# EAGLE design Active Load (EAGLE 7.2.0)
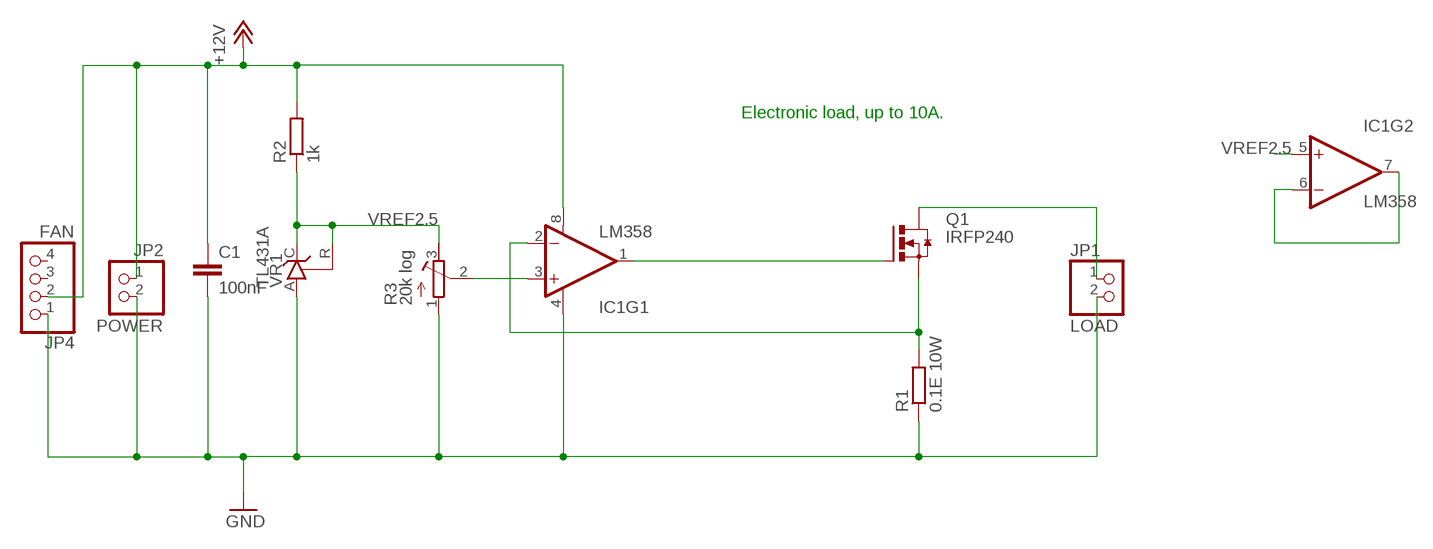
[diagram p0: schematic, sheet 1]

## Parts
C1  100nF  C-EU025-040X050  [C025-040X050]
IC1  LM358  [DIP08]
JP1  LOAD  PINHD-1X2  [1X02]
JP2  POWER  PINHD-1X2  [1X02]
JP4  FAN  PINHD-1X4  [1X04]
Q1  IRFP240  [TO247BV]
R1  0.1E 10W  R-EU_0922/22  [0922/22]
R2  1k  R-EU_0411/12  [0411/12]
R3  20k log  R-TRIMM74W  [RTRIM74W]
VR1  TL431A  TL431CLP  [TO92-CLP]

## Nets
+12V: C1.1 IC1.8(V+) JP2.1 JP4.2 R2.2
GND: C1.2 IC1.4(V-) JP1.2 JP2.2 JP4.1 R1.1 R3.1(A) VR1.A
N$1: IC1.6(-IN) IC1.7(OUT)
N$2: IC1.3(+IN) R3.2(S)
N$3: IC1.2(-IN) Q1.S R1.2
N$4: IC1.1(OUT) Q1.G
N$6: JP1.1 Q1.D
VREF2.5: IC1.5(+IN) R2.1 R3.3(E) VR1.C VR1.R
Unconnected: JP4.3 JP4.4

## Notes on the sheet
- Electronic load, up to 10A.

## Library data of the parts
C1 = rcl:C-EU: CAPACITOR, European symbol
IC1 = SparkFun-AnalogIC:LM358: Jellybean op-amp; PROD_ID: IC-09172
JP1 JP2 = pinhead:PINHD-1X2: PIN HEADER
JP4 = pinhead:PINHD-1X4: PIN HEADER
Q1 = transistor-power:IRFP240: HEXFET Power MosFet Source: http://www.irf.com/
R1 R2 = rcl:R-EU_: RESISTOR, European symbol
R3 = rcl:R-TRIMM: Trimm resistor
VR1 = v-reg:TL431CLP: VOLTAGE REGULATOR

## Board
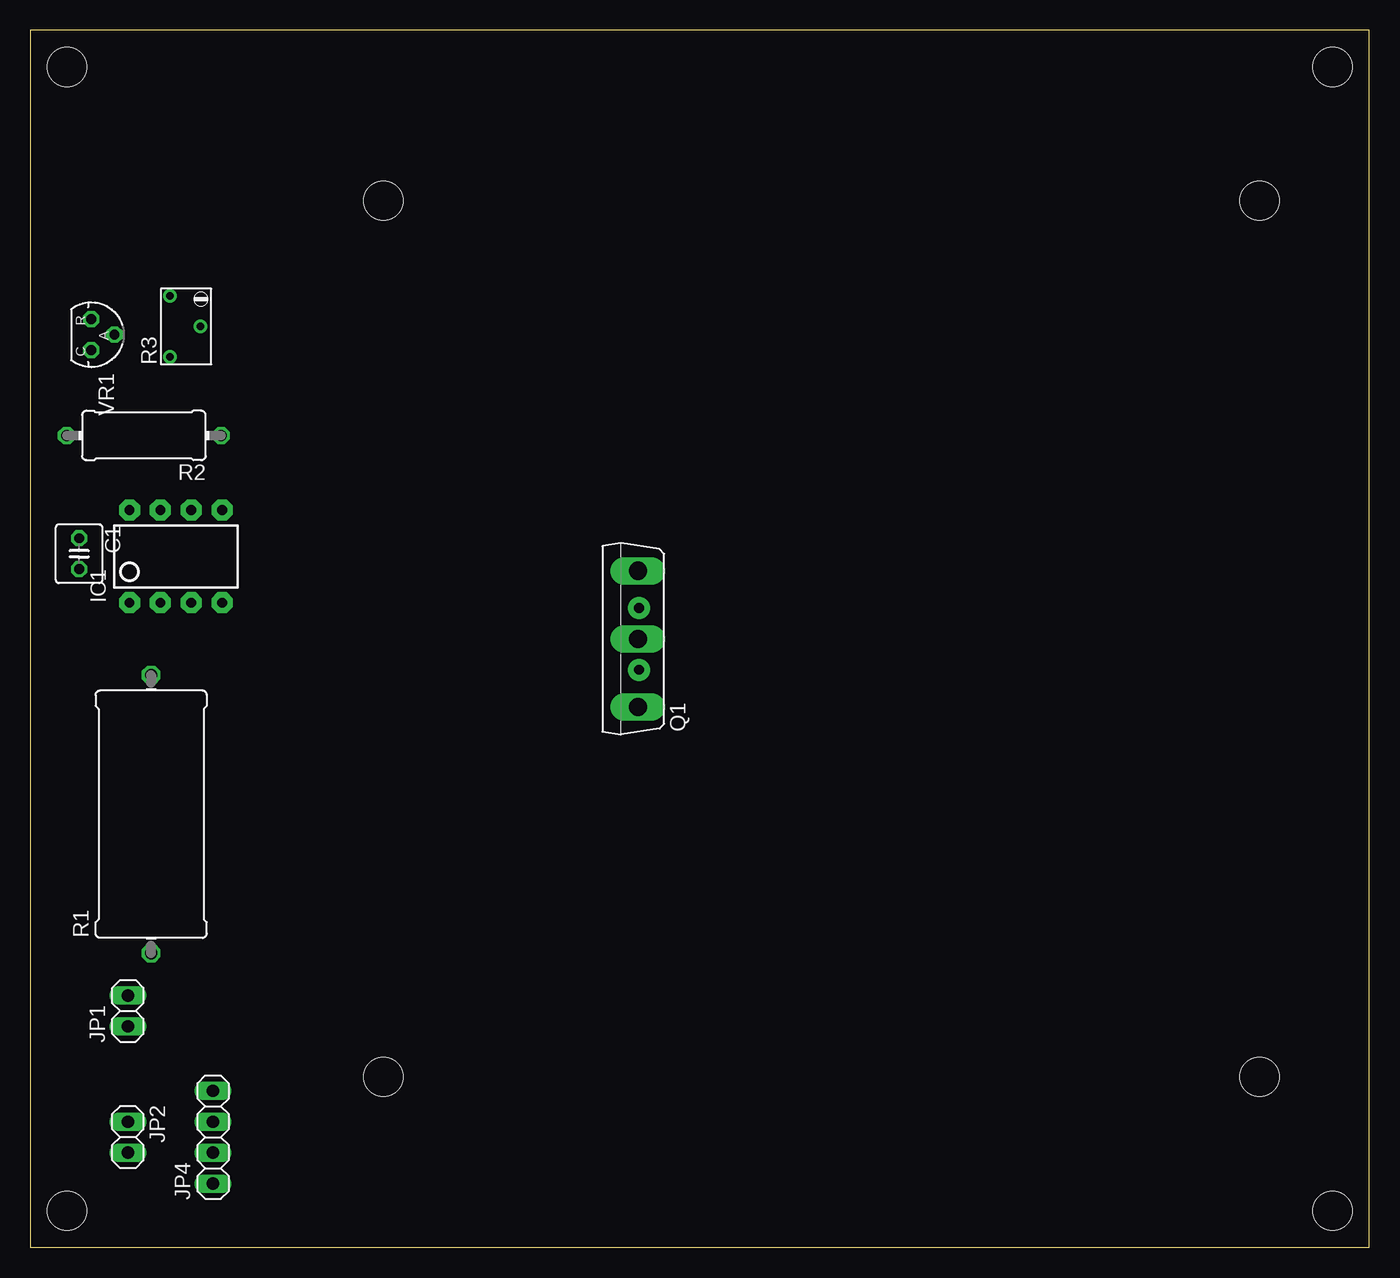
[diagram p1: board, top side]
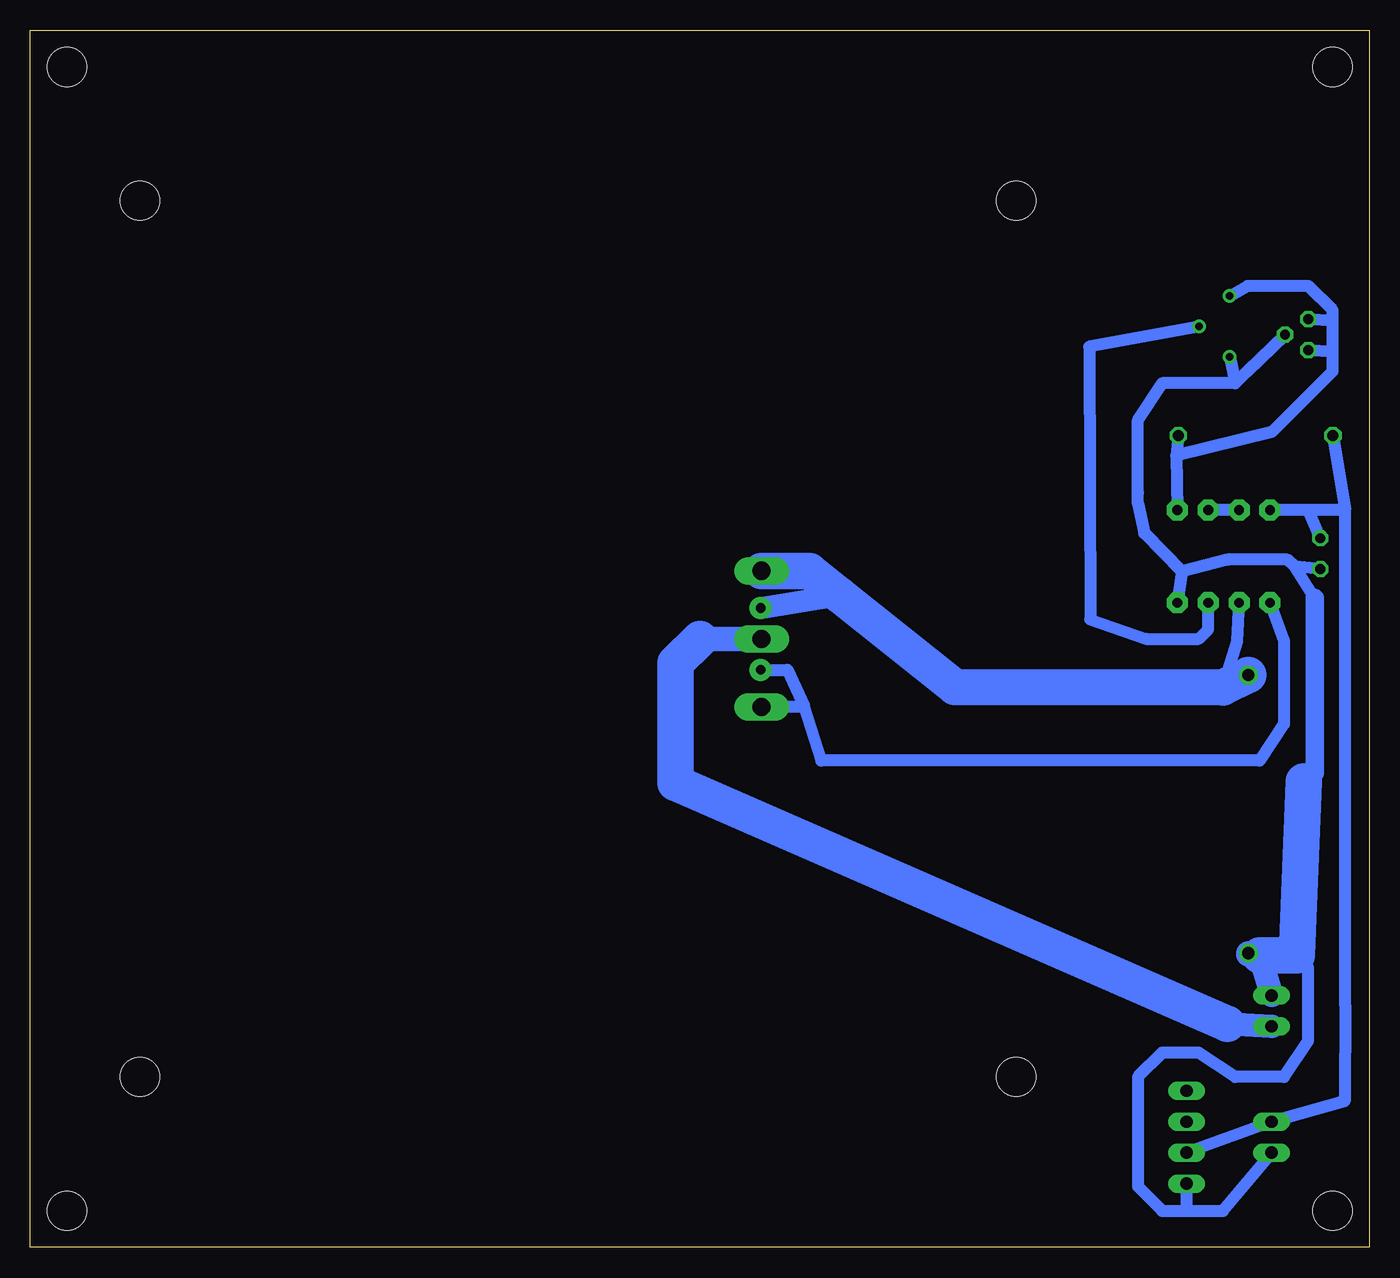
[diagram p2: board, bottom side, seen from below]

Size 110 x 100 mm. Coordinates in mm from the lower left corner, seen from the top.
Outline: 0,100 0,0 110,0 110,100 0,100
Copper layers (1*16): Top 0.035mm / dielectric 1.5mm / Bottom 0.035mm
Design rules "default": minimum track width 10mil, minimum drill 24mil, track to track 8mil, track to pad 8mil, pad to pad 8mil, via to via 8mil, smd to smd 8mil, copper to edge 40mil, drill to drill 8mil, minimum pad ring 10mil, minimum via ring 8mil, stop-mask expansion 4mil, vias tented up to drill 0mil, thermal gap 10mil
Holes 3.2 mm at 101,14 101,86 29,86 29,14 3,97 107,97 107,3 3,3

### Footprints (pad centres in the part's own frame; a part is rotated, then mirrored left to right if it is on the bottom)
C025-040X050 = drill 0.813 octagon: 1 -1.27,0; 2 1.27,0
DIP08 = drill 0.813 pad 1.727 octagon: 1 -3.81,-3.81; 2 -1.27,-3.81; 3 1.27,-3.81; 4 3.81,-3.81; 5 3.81,3.81; 6 1.27,3.81; 7 -1.27,3.81; 8 -3.81,3.81
1X02 = drill 1.016 long: 1 -1.27,0; 2 1.27,0
1X04 = drill 1.016 long: 1 -3.81,0; 2 -1.27,0; 3 1.27,0; 4 3.81,0
TO247BV = drill 1.499 long: D 0,-2.921; G -5.588,-2.921; S 5.588,-2.921
0922/22 = drill 1.016 octagon: 1 -11.43,0; 2 11.43,0
0411/12 = drill 0.914 octagon: 1 -6.35,0; 2 6.35,0
RTRIM74W = drill 0.61: 1 -1.25,-2.5; 2 1.25,0; 3 -1.25,2.5
TO92-CLP = drill 0.813 octagon: A 0,1.905; C 1.27,0; R -1.27,0

### Placement (x,y rotation side)
C1  4,57 270 top
IC1  11.95,56.78 0 top
JP1  8,19.43 90 top
JP2  8,9.05 270 top
JP4  15,9.05 90 top
Q1  47,50 90 top
R1  9.92,35.6 90 top
R2  9.32,66.71 180 top
R3  12.71,75.67 0 top
VR1  5,75 270 top

### Tracks (layer width: path | path; a pad name or v marks a point on that pad's centre or on a via)
+12V
  Bottom 1: 1.97,60.59 1.97,19.94 2,12 JP2.1 JP4.2 | 1.97,60.59 5,60.59 | 5,60.59 IC1.8 6.59,60.59 | R2.2 1.97,60.59 | C1.1 5,60.59
GND
  Bottom 1: 15.39,55.55 18.48,58.69 19.02,61.17 19,62 19,68 17,71 11,71 | 15.39,55.55 IC1.4 | 11,71 10,72 VR1.A | R3.1 11,71 | 4.45,53.34 6.09,55.96 | 6.09,55.96 6.71,56.52 11.61,56.52 15.39,55.55 | C1.2 6.09,55.96 | 9,24 5,23 5,17 7,14 11,14 14,16 17,16 19,14 19,5 17,3 15,3 | 15,3 12,3 JP2.2 | JP4.1 15,3
  Bottom 1.5: 4.45,53.34 4.45,39 5.37,38.27
  Bottom 1.93: 9,24 JP1.2 | 9.92,24.08 5.96,24
  Bottom 2: 9.92,24.08 R1.1
  Bottom 3: 5.37,38.27 5.96,24 9,24
N$1
  Bottom 1: IC1.7 IC1.6
N$2
  Bottom 1: IC1.3 13.22,50.78 14,50 18.31,50 22.92,51.61 23,74 R3.2
N$3  (via drill 0.8 pad 1.8)
  Bottom 0.254: 9.83,47.09 R1.2
  Bottom 1: IC1.2 10.83,49.81 12,46
  Bottom 1.8: v50,52.54 43.52,53.6
  Bottom 3: Q1.S 46,55.59 43.52,53.6 34.03,46.03 12,46 R1.2
N$4  (via drill 0.8 pad 1.8)
  Bottom 1: IC1.1 7,49.83 7,43 9,40 45,40 46.41,44.41 | 46.41,44.41 Q1.G | v50,47.46 47.79,47.46 46.41,44.41
N$6
  Bottom 1.93: 11.65,18.35 JP1.1
  Bottom 2: 55,50 Q1.D
  Bottom 3: 11.65,18.35 57,38.16 57,48 55,50
VREF2.5
  Bottom 1: R2.1 15.84,65.05 | 15.84,65.05 IC1.5 | 15.84,65.05 8,67 3,72 3,73.66 | 3,73.66 3,76.2 | 3,76.2 3,77 5,79 10,79 R3.3 | VR1.C 3,73.66 | VR1.R 3,76.2